# Altium schematic sheet power.SchDoc
size A3
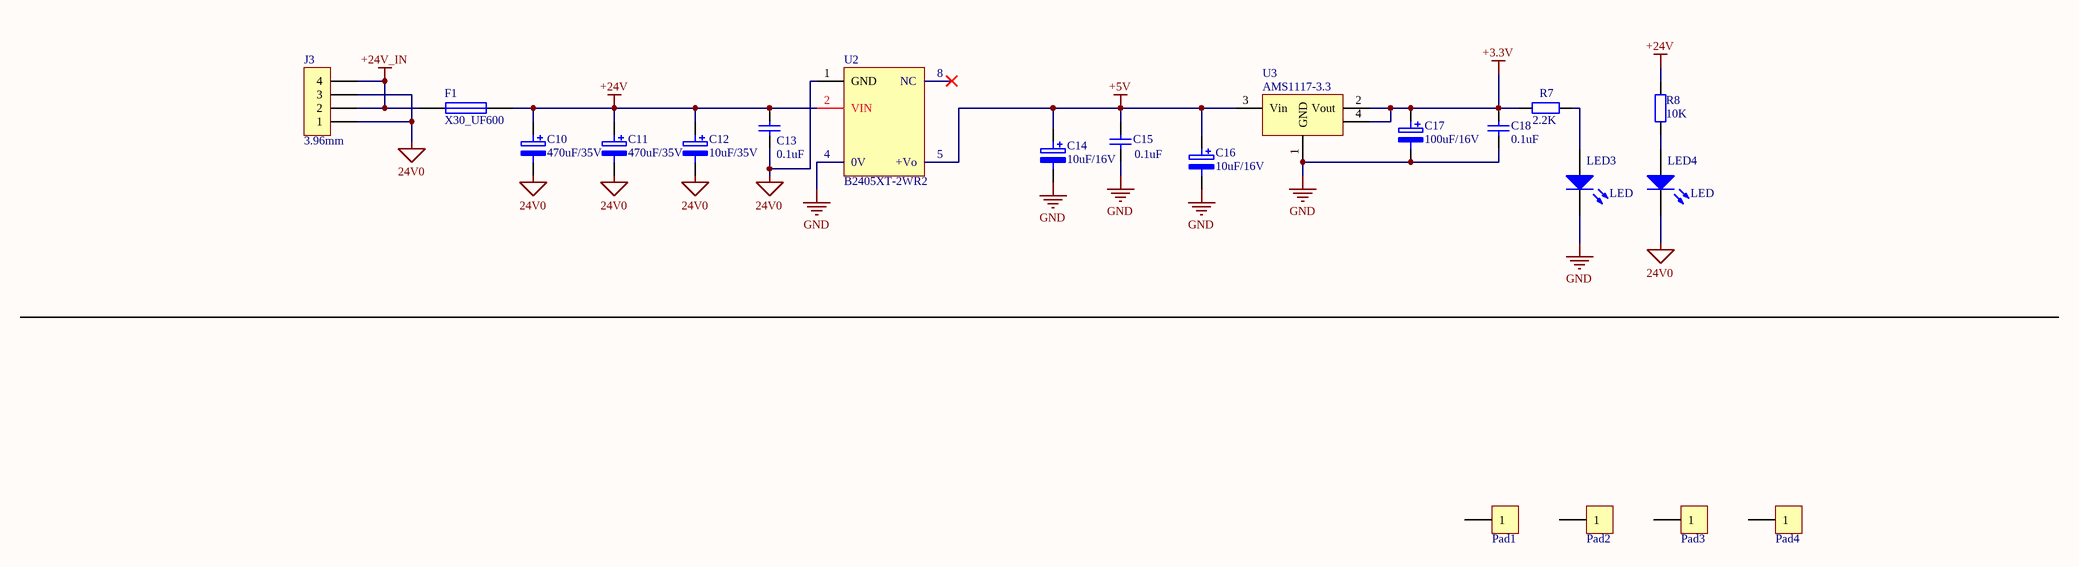
[diagram p0: power.SchDoc]

## Parts
C10  470uF/35V  [CE/10MM]
C11  470uF/35V  [CE/10MM]
C12  10uF/35V  [TC6032_C]
C13  0.1uF  [0805_CAP]
C14  10uF/16V  [CASE-A_3216]
C15  0.1uF  [0805_CAP]
C16  10uF/16V  [CASE-A_3216]
C17  100uF/16V  [TC6032_C]
C18  0.1uF  [0805_CAP]
F1  X30_UF600  [X30UF600]
J3  3.96mm  [VH3.96_4P]
LED3  LED  [0805-LED-G]
LED4  LED  [0805-LED-G]
Pad1  Pad  [pad35]  (value not drawn)
Pad2  Pad  [pad35]  (value not drawn)
Pad3  Pad  [pad35]  (value not drawn)
Pad4  Pad  [pad35]  (value not drawn)
R7  2.2K  [0805_RES]
R8  10K  [0805_RES]
U2  B2405XT-2WR2  [B2405XT-2WR2]
U3  AMS1117-3.3  [SOT223_3]

## Nets
24V0: C10.2 C11.2 C12.2 C13.1 J3.1 J3.3 LED4.2(K) U2.1(GND)
+3.3V: C17.1 C18.2 R7.2 U3.2(Vout) U3.4
+5V: C14.1 C15.2 C16.1 U2.5(+Vo) U3.3(Vin)
+24V: C10.1 C11.1 C12.1 C13.2 F1.2 R8.2 U2.2(VIN)
+24V_IN: F1.1 J3.2 J3.4
GND: C14.2 C15.1 C16.2 C17.2 C18.1 LED3.2(K) U2.4(0V) U3.1(GND)
NetLED3_1: LED3.1(A) R7.1
NetLED4_1: LED4.1(A) R8.1

Not connected (* = marked no-connect by the designer): Pad1 1; Pad2 1; Pad3 1; Pad4 1; U2 8(NC)*

## Notes on the sheet
- 电源电路

## Library data of the parts
C10-C12 C14 C16 C17 = ELECTRO2: Electrolytic Capacitor
C13 C15 C18 = Cap: Capacitor; Published: 8-Jun-2000; LatestRevisionDate: 17-Jul-2002; LatestRevisionNote: Re-released for DXP Platform.; PackageReference: RAD-0.3; Publisher: Altium Limited
  C13 C18: Value: 0.1uF
F1 = Fuse 1: Fuse; Published: 8-Jun-2000; LatestRevisionDate: 17-Jul-2002; LatestRevisionNote: Re-released for DXP Platform.; PackageReference: PIN-W2/E2.8; Publisher: Altium Limited
J3 = CON4: Connector
LED3 LED4 = LED2: Typical RED, GREEN, YELLOW, AMBER GaAs LED; Published: 8-Jun-2000; LatestRevisionDate: 17-Jul-2002; LatestRevisionNote: Re-released for DXP Platform.; PackageDocument: Feb-2002; PackageReference: 3.2X1.6X1.1; Publisher: Altium Limited
R7 R8 = Res2: Resistor; Published: 8-Jun-2000; LatestRevisionDate: 17-Jul-2002; LatestRevisionNote: Re-released for DXP Platform.; PackageReference: AXIAL-0.4; Publisher: Altium Limited
  R7: Value: 2.2K
  R8: Value: 10K
U3 = AMS1117-5